# Altium schematic sheet RS485.SchDoc
size A4
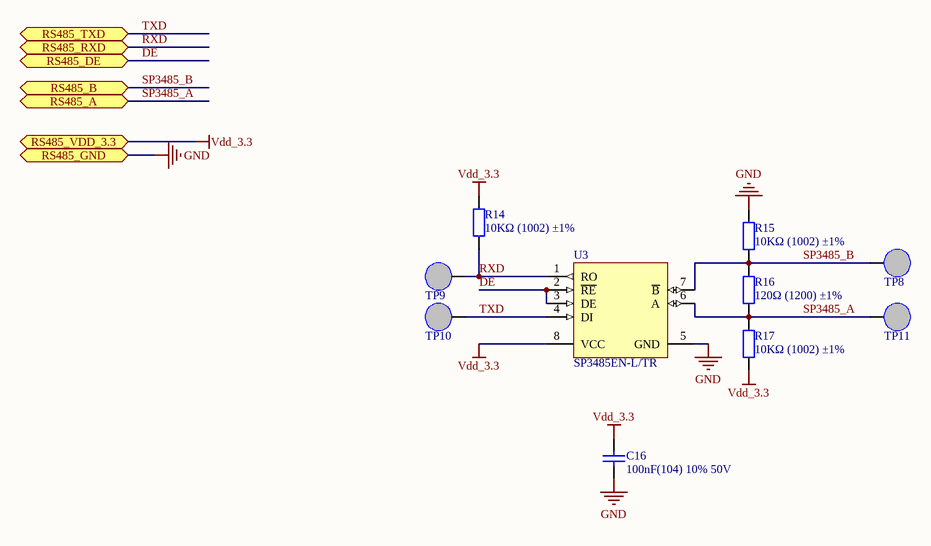
[diagram p0: RS485.SchDoc]

## Parts
C16  100nF(104) 10% 50V  [0805_C]
R14  10KΩ (1002) ±1%  [0805_R]
R15  10KΩ (1002) ±1%  [0805_R]
R16  120Ω (1200) ±1%  [0805_R]
R17  10KΩ (1002) ±1%  [0805_R]
TP8  TP  [TP]  (value not drawn)
TP9  TP  [TP]  (value not drawn)
TP10  TP  [TP]  (value not drawn)
TP11  TP  [TP]  (value not drawn)
U3  SP3485EN-L/TR  [SOIC-8_150mil]

## Ports
RS485_A, RS485_B, RS485_DE, RS485_GND, RS485_RXD, RS485_TXD, RS485_VDD_3.3

## Nets
GND: C16.2 R15.2 U3.5(GND) ; port RS485_GND
Vdd_3.3: C16.1 R14.2 R17.1 U3.8(VCC) ; port RS485_VDD_3.3
DE: U3.2(~{RE}) U3.3(DE) ; port RS485_DE
RXD: R14.1 TP9.1 U3.1(RO) ; port RS485_RXD
SP3485_A: R16.1 R17.2 TP11.1 U3.6(A) ; port RS485_A
SP3485_B: R15.1 R16.2 TP8.1 U3.7(~{B}) ; port RS485_B
TXD: TP10.1 U3.4(DI) ; port RS485_TXD

## Library data of the parts
C16 = 0805 100nF(104) 10% 50V: 贴片电容; ComponentLink1Description: 供应商链接; ComponentLink1URL: http://www.szlcsc.com/product/details_50686.html; Package: 0805; Supplier: LC; SuppliersPartNumber: C49678
R14 R15 R17 = 0805 10KΩ (1002) 1%: 贴片电阻; ComponentLink1Description: 供应商链接; ComponentLink1URL: http://www.szlcsc.com/product/details_18102.html; Package: 0805; Supplier: LC; SuppliersPartNumber: C17414
R16 = 0805 120Ω (1200) 1%: 贴片电阻; ComponentLink1Description: 供应商链接; ComponentLink1URL: http://www.szlcsc.com/product/details_18125.html; Package: 0805; Supplier: LC; SuppliersPartNumber: C17437
U3 = SP3485EN-L/TR_[C8963]: RS-485/RS-422; ComponentLink1Description: 供应商链接; ComponentLink1URL: http://www.szlcsc.com/product/details_9482.html; Package: SOIC-8; Supplier: LC; SuppliersPartNumber: C8963